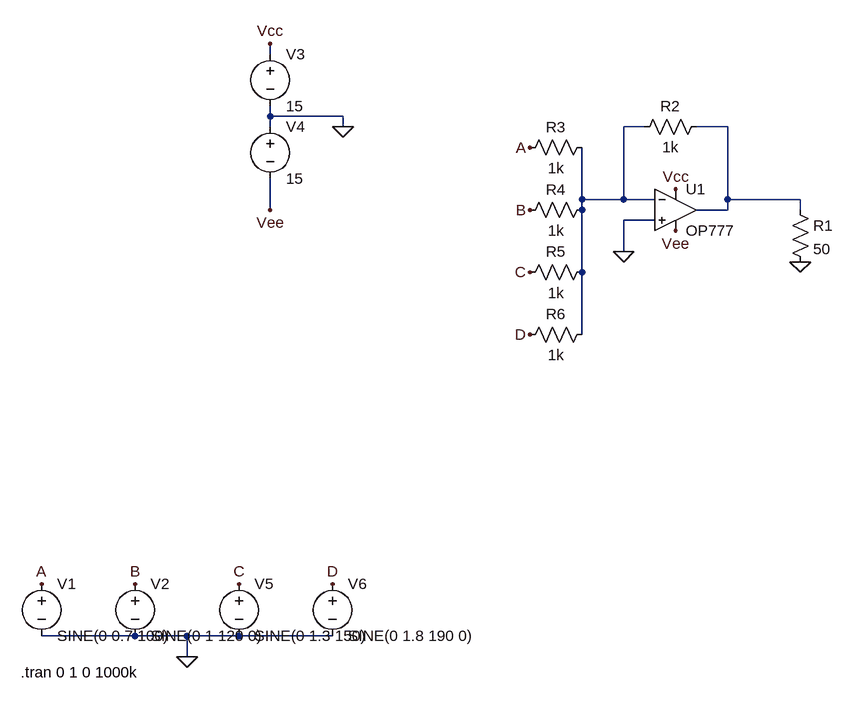
[diagram p0: schematic FFT.asc]
FFT.asc, the LTspice schematic file:
Version 4.1
SHEET 1 880 904
WIRE -192 -64 -192 -80
WIRE -192 32 -192 16
WIRE -80 32 -192 32
WIRE -192 48 -192 32
WIRE -80 48 -80 32
WIRE 384 48 352 48
WIRE 512 48 464 48
WIRE 288 160 288 80
WIRE 352 160 352 48
WIRE 352 160 288 160
WIRE 400 160 352 160
WIRE 512 160 512 48
WIRE 624 160 512 160
WIRE -192 176 -192 128
WIRE 288 176 288 160
WIRE 512 176 512 160
WIRE 512 176 464 176
WIRE 624 176 624 160
WIRE 400 192 352 192
WIRE 352 240 352 192
WIRE 288 272 288 176
WIRE 288 368 288 272
WIRE -400 832 -544 832
WIRE -320 832 -400 832
WIRE -240 832 -320 832
WIRE -96 832 -240 832
WIRE -320 864 -320 832
FLAG -192 -80 Vcc
FLAG -192 176 Vee
FLAG -80 48 0
FLAG 624 256 0
FLAG 432 144 Vcc
FLAG 432 208 Vee
FLAG 352 240 0
FLAG -320 864 0
FLAG -544 752 A
FLAG -400 752 B
FLAG -240 752 C
FLAG -96 752 D
FLAG 208 80 A
FLAG 208 176 B
FLAG 208 272 C
FLAG 208 368 D
SYMBOL OpAmps\\OP777 432 112 R0
SYMATTR InstName U1
SYMBOL voltage -192 -80 R0
WINDOW 123 0 0 Left 0
WINDOW 39 0 0 Left 0
SYMATTR InstName V3
SYMATTR Value 15
SYMBOL voltage -192 32 R0
WINDOW 123 0 0 Left 0
WINDOW 39 0 0 Left 0
SYMATTR InstName V4
SYMATTR Value 15
SYMBOL res 608 160 R0
SYMATTR InstName R1
SYMATTR Value 50
SYMBOL res 480 32 R90
WINDOW 0 0 56 VBottom 2
WINDOW 3 32 56 VTop 2
SYMATTR InstName R2
SYMATTR Value 1k
SYMBOL res 304 64 R90
WINDOW 0 0 56 VBottom 2
WINDOW 3 32 56 VTop 2
SYMATTR InstName R3
SYMATTR Value 1k
SYMBOL res 304 160 R90
WINDOW 0 0 56 VBottom 2
WINDOW 3 32 56 VTop 2
SYMATTR InstName R4
SYMATTR Value 1k
SYMBOL res 304 256 R90
WINDOW 0 0 56 VBottom 2
WINDOW 3 32 56 VTop 2
SYMATTR InstName R5
SYMATTR Value 1k
SYMBOL res 304 352 R90
WINDOW 0 0 56 VBottom 2
WINDOW 3 32 56 VTop 2
SYMATTR InstName R6
SYMATTR Value 1k
SYMBOL voltage -544 736 R0
WINDOW 123 0 0 Left 0
WINDOW 39 0 0 Left 0
SYMATTR InstName V1
SYMATTR Value SINE(0 0.7 100)
SYMBOL voltage -400 736 R0
WINDOW 123 0 0 Left 0
WINDOW 39 0 0 Left 0
SYMATTR InstName V2
SYMATTR Value SINE(0 1 120 0)
SYMBOL voltage -240 736 R0
WINDOW 123 0 0 Left 0
WINDOW 39 0 0 Left 0
SYMATTR InstName V5
SYMATTR Value SINE(0 1.3 150)
SYMBOL voltage -96 736 R0
WINDOW 123 0 0 Left 0
WINDOW 39 0 0 Left 0
SYMATTR InstName V6
SYMATTR Value SINE(0 1.8 190 0)
TEXT -576 888 Left 2 !.tran 0 1 0 1000k

The netlist it stands for:
* FFT.asc
X§U1 0 N001 Vcc Vee N002 OP777  ; pins In+ In- V+ V- OUT
V3 Vcc 0 15
V4 0 Vee 15
R1 N002 0 50
R2 N002 N001 1k
R3 N001 A 1k
R4 N001 B 1k
R5 N001 C 1k
R6 N001 D 1k
V1 A 0 SINE(0 0.7 100)
V2 B 0 SINE(0 1 120 0)
V5 C 0 SINE(0 1.3 150)
V6 D 0 SINE(0 1.8 190 0)
.tran 0 1 0 1000k
.lib ADI.lib
.backanno
.end